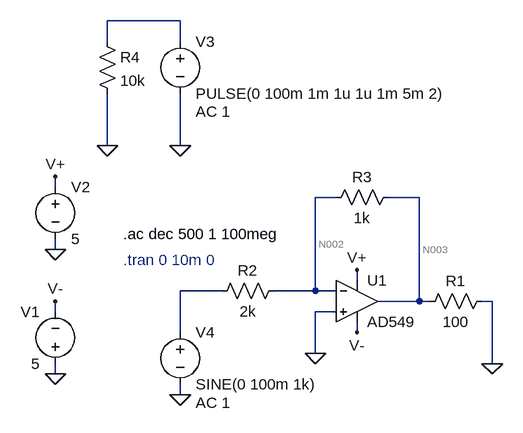
[diagram p0: schematic lab6d.asc]
lab6d.asc, the LTspice schematic file:
Version 4.1
SHEET 1 880 680
WIRE -64 -304 -176 -304
WIRE -176 -272 -176 -304
WIRE -64 -272 -64 -304
WIRE -176 -112 -176 -192
WIRE -64 -112 -64 -192
WIRE -256 -48 -256 -64
WIRE 176 -32 144 -32
WIRE 304 -32 256 -32
WIRE -256 48 -256 32
WIRE 208 96 208 80
WIRE 0 112 -64 112
WIRE 144 112 144 -32
WIRE 144 112 80 112
WIRE 176 112 144 112
WIRE 304 128 304 -32
WIRE 304 128 240 128
WIRE 320 128 304 128
WIRE 416 128 400 128
WIRE -256 144 -256 128
WIRE 176 144 144 144
WIRE -64 176 -64 112
WIRE 208 176 208 160
WIRE 144 208 144 144
WIRE 416 224 416 128
WIRE -256 240 -256 224
WIRE -64 272 -64 256
FLAG 416 224 0
FLAG -256 240 0
FLAG -256 48 0
FLAG -256 -64 V+
FLAG -256 128 V-
FLAG 208 80 V+
FLAG 208 176 V-
FLAG -64 272 0
FLAG 144 208 0
FLAG -64 -112 0
FLAG -176 -112 0
SYMBOL OpAmps\\AD549 208 64 R0
SYMATTR InstName U1
SYMBOL voltage -256 240 R180
WINDOW 0 24 96 Left 2
WINDOW 3 24 16 Left 2
WINDOW 123 0 0 Left 0
WINDOW 39 0 0 Left 0
SYMATTR InstName V1
SYMATTR Value 5
SYMBOL voltage -256 -64 R0
WINDOW 123 0 0 Left 0
WINDOW 39 0 0 Left 0
SYMATTR InstName V2
SYMATTR Value 5
SYMBOL res 416 112 R90
WINDOW 0 0 56 VBottom 2
WINDOW 3 32 56 VTop 2
SYMATTR InstName R1
SYMATTR Value 100
SYMBOL voltage -64 -288 R0
WINDOW 123 24 124 Left 2
WINDOW 39 0 0 Left 0
SYMATTR Value2 AC 1
SYMATTR InstName V3
SYMATTR Value PULSE(0 100m 1m 1u 1u 1m 5m 2)
SYMBOL voltage -64 160 R0
WINDOW 123 24 124 Left 2
WINDOW 39 0 0 Left 0
SYMATTR Value2 AC 1
SYMATTR InstName V4
SYMATTR Value SINE(0 100m 1k)
SYMBOL res 96 96 R90
WINDOW 0 0 56 VBottom 2
WINDOW 3 32 56 VTop 2
SYMATTR InstName R2
SYMATTR Value 2k
SYMBOL res 272 -48 R90
WINDOW 0 0 56 VBottom 2
WINDOW 3 32 56 VTop 2
SYMATTR InstName R3
SYMATTR Value 1k
SYMBOL res -192 -288 R0
SYMATTR InstName R4
SYMATTR Value 10k
TEXT -152 24 Left 2 !.ac dec 500 1 100meg
TEXT -152 64 Left 2 ;.tran 0 10m 0

The netlist it stands for:
* lab6d.asc
X§U1 0 N002 V+ V- N003 AD549  ; pins In+ In- V+ V- OUT
V1 0 V- 5
V2 V+ 0 5
R1 0 N003 100
V3 N001 0 PULSE(0 100m 1m 1u 1u 1m 5m 2) AC 1
V4 N004 0 SINE(0 100m 1k) AC 1
R2 N002 N004 2k
R3 N003 N002 1k
R4 N001 0 10k
.ac dec 500 1 100meg
* .tran 0 10m 0
.backanno
.end

* Results of the author's LTspice run, read from the files saved beside the schematic
* Operating Point, zero values left out:
*   V(n002) = -359 nV
*   V(n003) = -538.4 nV
*   V(v+) = 5 V
*   V(v-) = -5 V
*   I(R1) = 5.384 nA
*   I(R2) = -179.5 pA
*   I(R3) = -179.5 pA
*   I(V1) = -794.4 µA
*   I(V2) = -794.4 µA
*   I(V4) = -179.5 pA
*   Ix(u1:3) = 794.4 µA
*   Ix(u1:4) = -794.4 µA
*   Ix(u1:5) = 5.563 nA
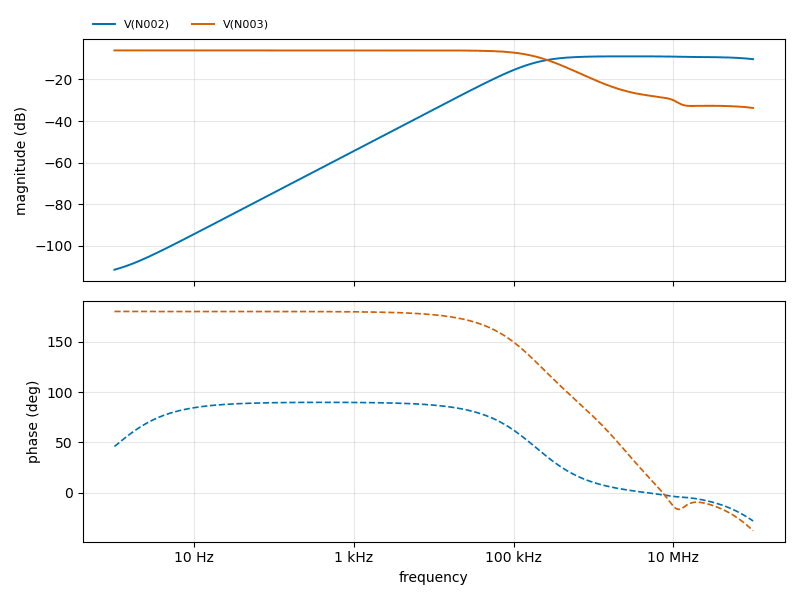
[diagram p1: AC Analysis of lab6d.asc, plotted from the saved traces]
* AC Analysis, 1 run:
*   V(N002): -111.51 dB at 1 Hz, -10.24 dB at 100 MHz, peak -8.86 dB at 2.767 MHz, 3 dB below the peak at 188 kHz
*   V(N003): -6.02 dB at 1 Hz, -33.71 dB at 100 MHz, peak -6.02 dB at 1 Hz, 3 dB below the peak at 191 kHz